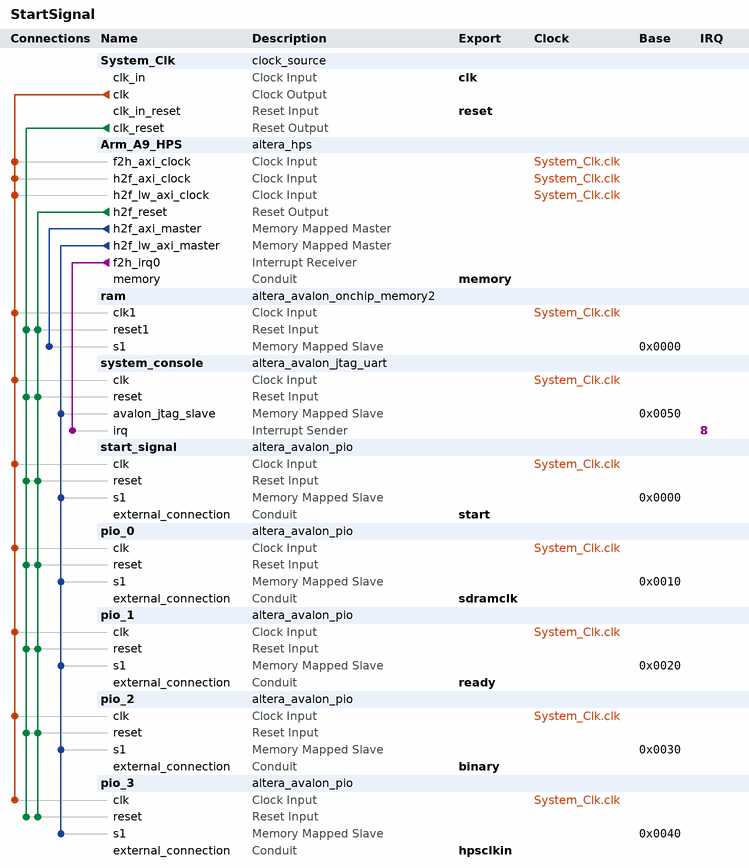
[diagram p0: system contents]
# Platform Designer (Qsys) system StartSignal, Cyclone V 5CSEMA5F31C6
# Parameters at their usual value, and those the tool derives, are not listed.
package require -exact qsys 13.1
create_system StartSignal
set_project_property DEVICE_FAMILY {Cyclone V}
set_project_property DEVICE 5CSEMA5F31C6

add_instance System_Clk clock_source 13.1
set_instance_parameter_value System_Clk clockFrequency 50000000

add_instance Arm_A9_HPS altera_hps 13.1
set_instance_parameter_value Arm_A9_HPS MEM_VENDOR JEDEC
set_instance_parameter_value Arm_A9_HPS MEM_CLK_FREQ_MAX 400.0
set_instance_parameter_value Arm_A9_HPS MEM_ROW_ADDR_WIDTH 12
set_instance_parameter_value Arm_A9_HPS MEM_COL_ADDR_WIDTH 8
set_instance_parameter_value Arm_A9_HPS MEM_DQ_WIDTH 8
set_instance_parameter_value Arm_A9_HPS MEM_BANKADDR_WIDTH 3
set_instance_parameter_value Arm_A9_HPS MEM_DRV_STR RZQ/6
set_instance_parameter_value Arm_A9_HPS MEM_RTT_NOM RZQ/6
set_instance_parameter_value Arm_A9_HPS MEM_RTT_WR {Dynamic ODT off}
set_instance_parameter_value Arm_A9_HPS MEM_WTCL 6
set_instance_parameter_value Arm_A9_HPS MEM_TCL 7
set_instance_parameter_value Arm_A9_HPS TIMING_TIS 175
set_instance_parameter_value Arm_A9_HPS TIMING_TIH 250
set_instance_parameter_value Arm_A9_HPS TIMING_TDS 50
set_instance_parameter_value Arm_A9_HPS TIMING_TDH 125
set_instance_parameter_value Arm_A9_HPS TIMING_TDQSQ 120
set_instance_parameter_value Arm_A9_HPS TIMING_TDQSCK 400
set_instance_parameter_value Arm_A9_HPS TIMING_TQSH 0.38
set_instance_parameter_value Arm_A9_HPS MEM_TINIT_US 499
set_instance_parameter_value Arm_A9_HPS MEM_TMRD_CK 3
set_instance_parameter_value Arm_A9_HPS MEM_TRAS_NS 40.0
set_instance_parameter_value Arm_A9_HPS MEM_TRCD_NS 15.0
set_instance_parameter_value Arm_A9_HPS MEM_TRP_NS 15.0
set_instance_parameter_value Arm_A9_HPS MEM_TREFI_US 7.0
set_instance_parameter_value Arm_A9_HPS MEM_TRFC_NS 75.0
set_instance_parameter_value Arm_A9_HPS MEM_TWTR 2
set_instance_parameter_value Arm_A9_HPS MEM_TFAW_NS 37.5
set_instance_parameter_value Arm_A9_HPS REF_CLK_FREQ 125.0
set_instance_parameter_value Arm_A9_HPS DEFAULT_FAST_SIM_MODEL true
set_instance_parameter_value Arm_A9_HPS TIMING_BOARD_MAX_CK_DELAY 0.6
set_instance_parameter_value Arm_A9_HPS TIMING_BOARD_MAX_DQS_DELAY 0.6
set_instance_parameter_value Arm_A9_HPS TIMING_BOARD_SKEW_CKDQS_DIMM_MIN -0.01
set_instance_parameter_value Arm_A9_HPS TIMING_BOARD_SKEW_CKDQS_DIMM_MAX 0.01
set_instance_parameter_value Arm_A9_HPS TIMING_BOARD_SKEW_WITHIN_DQS 0.02
set_instance_parameter_value Arm_A9_HPS TIMING_BOARD_SKEW_BETWEEN_DQS 0.02
set_instance_parameter_value Arm_A9_HPS TIMING_BOARD_DQ_TO_DQS_SKEW 0.0
set_instance_parameter_value Arm_A9_HPS TIMING_BOARD_AC_SKEW 0.02
set_instance_parameter_value Arm_A9_HPS TIMING_BOARD_AC_TO_CK_SKEW 0.0
set_instance_parameter_value Arm_A9_HPS MEM_CLK_FREQ 300.0
set_instance_parameter_value Arm_A9_HPS HPS_PROTOCOL DDR3
set_instance_parameter_value Arm_A9_HPS STM_Enable false
set_instance_parameter_value Arm_A9_HPS F2S_Width 2
set_instance_parameter_value Arm_A9_HPS S2F_Width 3
set_instance_parameter_value Arm_A9_HPS LWH2F_Enable true
set_instance_parameter_value Arm_A9_HPS F2SCLK_DBGRST_Enable false
set_instance_parameter_value Arm_A9_HPS F2SCLK_WARMRST_Enable false
set_instance_parameter_value Arm_A9_HPS F2SCLK_COLDRST_Enable false
set_instance_parameter_value Arm_A9_HPS F2SINTERRUPT_Enable true
set_instance_parameter_value Arm_A9_HPS EMAC1_PinMuxing Unused
set_instance_parameter_value Arm_A9_HPS EMAC1_Mode N/A
set_instance_parameter_value Arm_A9_HPS QSPI_PinMuxing Unused
set_instance_parameter_value Arm_A9_HPS QSPI_Mode N/A
set_instance_parameter_value Arm_A9_HPS SDIO_PinMuxing Unused
set_instance_parameter_value Arm_A9_HPS SDIO_Mode N/A
set_instance_parameter_value Arm_A9_HPS USB1_PinMuxing Unused
set_instance_parameter_value Arm_A9_HPS USB1_Mode N/A
set_instance_parameter_value Arm_A9_HPS SPIM1_PinMuxing Unused
set_instance_parameter_value Arm_A9_HPS SPIM1_Mode N/A
set_instance_parameter_value Arm_A9_HPS UART0_PinMuxing Unused
set_instance_parameter_value Arm_A9_HPS UART0_Mode N/A
set_instance_parameter_value Arm_A9_HPS I2C0_PinMuxing Unused
set_instance_parameter_value Arm_A9_HPS I2C0_Mode N/A
set_instance_parameter_value Arm_A9_HPS I2C1_PinMuxing Unused
set_instance_parameter_value Arm_A9_HPS I2C1_Mode N/A
set_instance_parameter_value Arm_A9_HPS S2FCLK_USER1CLK_FREQ 100
set_instance_parameter_value Arm_A9_HPS FPGA_PERIPHERAL_OUTPUT_CLOCK_FREQ_EMAC0_MD_CLK 100
set_instance_parameter_value Arm_A9_HPS FPGA_PERIPHERAL_OUTPUT_CLOCK_FREQ_EMAC0_GTX_CLK 100
set_instance_parameter_value Arm_A9_HPS FPGA_PERIPHERAL_OUTPUT_CLOCK_FREQ_EMAC1_MD_CLK 100
set_instance_parameter_value Arm_A9_HPS FPGA_PERIPHERAL_OUTPUT_CLOCK_FREQ_EMAC1_GTX_CLK 100

add_instance ram altera_avalon_onchip_memory2 13.1
set_instance_parameter_value ram dataWidth 32
set_instance_parameter_value ram dualPort false
set_instance_parameter_value ram initMemContent true
set_instance_parameter_value ram initializationFileName onchip_mem.hex
set_instance_parameter_value ram memorySize 16384

add_instance system_console altera_avalon_jtag_uart 13.1
set_instance_parameter_value system_console simInteractiveOptions NO_INTERACTIVE_WINDOWS

add_instance start_signal altera_avalon_pio 13.1
set_instance_parameter_value start_signal direction Output
set_instance_parameter_value start_signal width 3

add_instance pio_0 altera_avalon_pio 13.1
set_instance_parameter_value pio_0 direction Output
set_instance_parameter_value pio_0 simDoTestBenchWiring true
set_instance_parameter_value pio_0 width 2

add_instance pio_1 altera_avalon_pio 13.1
set_instance_parameter_value pio_1 direction Output
set_instance_parameter_value pio_1 width 1

add_instance pio_2 altera_avalon_pio 13.1
set_instance_parameter_value pio_2 direction Input
set_instance_parameter_value pio_2 simDoTestBenchWiring true
set_instance_parameter_value pio_2 width 16

add_instance pio_3 altera_avalon_pio 13.1
set_instance_parameter_value pio_3 direction Input
set_instance_parameter_value pio_3 simDoTestBenchWiring true
set_instance_parameter_value pio_3 width 1

# connections
add_connection System_Clk.clk Arm_A9_HPS.f2h_axi_clock clock
add_connection System_Clk.clk Arm_A9_HPS.h2f_axi_clock clock
add_connection System_Clk.clk Arm_A9_HPS.h2f_lw_axi_clock clock
add_connection System_Clk.clk pio_0.clk clock
add_connection System_Clk.clk pio_1.clk clock
add_connection System_Clk.clk pio_2.clk clock
add_connection System_Clk.clk pio_3.clk clock
add_connection System_Clk.clk ram.clk1 clock
add_connection System_Clk.clk start_signal.clk clock
add_connection System_Clk.clk system_console.clk clock
add_connection Arm_A9_HPS.h2f_reset pio_0.reset reset
add_connection Arm_A9_HPS.h2f_reset pio_1.reset reset
add_connection Arm_A9_HPS.h2f_reset pio_2.reset reset
add_connection Arm_A9_HPS.h2f_reset pio_3.reset reset
add_connection Arm_A9_HPS.h2f_reset ram.reset1 reset
add_connection Arm_A9_HPS.h2f_reset start_signal.reset reset
add_connection Arm_A9_HPS.h2f_reset system_console.reset reset
add_connection System_Clk.clk_reset pio_0.reset reset
add_connection System_Clk.clk_reset pio_1.reset reset
add_connection System_Clk.clk_reset pio_2.reset reset
add_connection System_Clk.clk_reset pio_3.reset reset
add_connection System_Clk.clk_reset ram.reset1 reset
add_connection System_Clk.clk_reset start_signal.reset reset
add_connection System_Clk.clk_reset system_console.reset reset
add_connection Arm_A9_HPS.h2f_axi_master ram.s1 avalon
set_connection_parameter_value Arm_A9_HPS.h2f_axi_master/ram.s1 baseAddress 0x0000
add_connection Arm_A9_HPS.h2f_lw_axi_master pio_0.s1 avalon
set_connection_parameter_value Arm_A9_HPS.h2f_lw_axi_master/pio_0.s1 baseAddress 0x0010
add_connection Arm_A9_HPS.h2f_lw_axi_master pio_1.s1 avalon
set_connection_parameter_value Arm_A9_HPS.h2f_lw_axi_master/pio_1.s1 baseAddress 0x0020
add_connection Arm_A9_HPS.h2f_lw_axi_master pio_2.s1 avalon
set_connection_parameter_value Arm_A9_HPS.h2f_lw_axi_master/pio_2.s1 baseAddress 0x0030
add_connection Arm_A9_HPS.h2f_lw_axi_master pio_3.s1 avalon
set_connection_parameter_value Arm_A9_HPS.h2f_lw_axi_master/pio_3.s1 baseAddress 0x0040
add_connection Arm_A9_HPS.h2f_lw_axi_master start_signal.s1 avalon
set_connection_parameter_value Arm_A9_HPS.h2f_lw_axi_master/start_signal.s1 baseAddress 0x0000
add_connection Arm_A9_HPS.h2f_lw_axi_master system_console.avalon_jtag_slave avalon
set_connection_parameter_value Arm_A9_HPS.h2f_lw_axi_master/system_console.avalon_jtag_slave baseAddress 0x0050
add_connection Arm_A9_HPS.f2h_irq0 system_console.irq interrupt
set_connection_parameter_value Arm_A9_HPS.f2h_irq0/system_console.irq irqNumber 8

# exported interfaces
add_interface clk clock sink
set_interface_property clk EXPORT_OF System_Clk.clk_in
add_interface reset reset sink
set_interface_property reset EXPORT_OF System_Clk.clk_in_reset
add_interface memory conduit end
set_interface_property memory EXPORT_OF Arm_A9_HPS.memory
add_interface start conduit end
set_interface_property start EXPORT_OF start_signal.external_connection
add_interface sdramclk conduit end
set_interface_property sdramclk EXPORT_OF pio_0.external_connection
add_interface ready conduit end
set_interface_property ready EXPORT_OF pio_1.external_connection
add_interface binary conduit end
set_interface_property binary EXPORT_OF pio_2.external_connection
add_interface hpsclkin conduit end
set_interface_property hpsclkin EXPORT_OF pio_3.external_connection

set_interconnect_requirement {$system} qsys_mm.clockCrossingAdapter HANDSHAKE
set_interconnect_requirement {$system} qsys_mm.maxAdditionalLatency 1
set_interconnect_requirement {$system} qsys_mm.insertDefaultSlave false

save_system StartSignal.qsys
